# Altium schematic sheet BMS_rev2.SchDoc
size A4
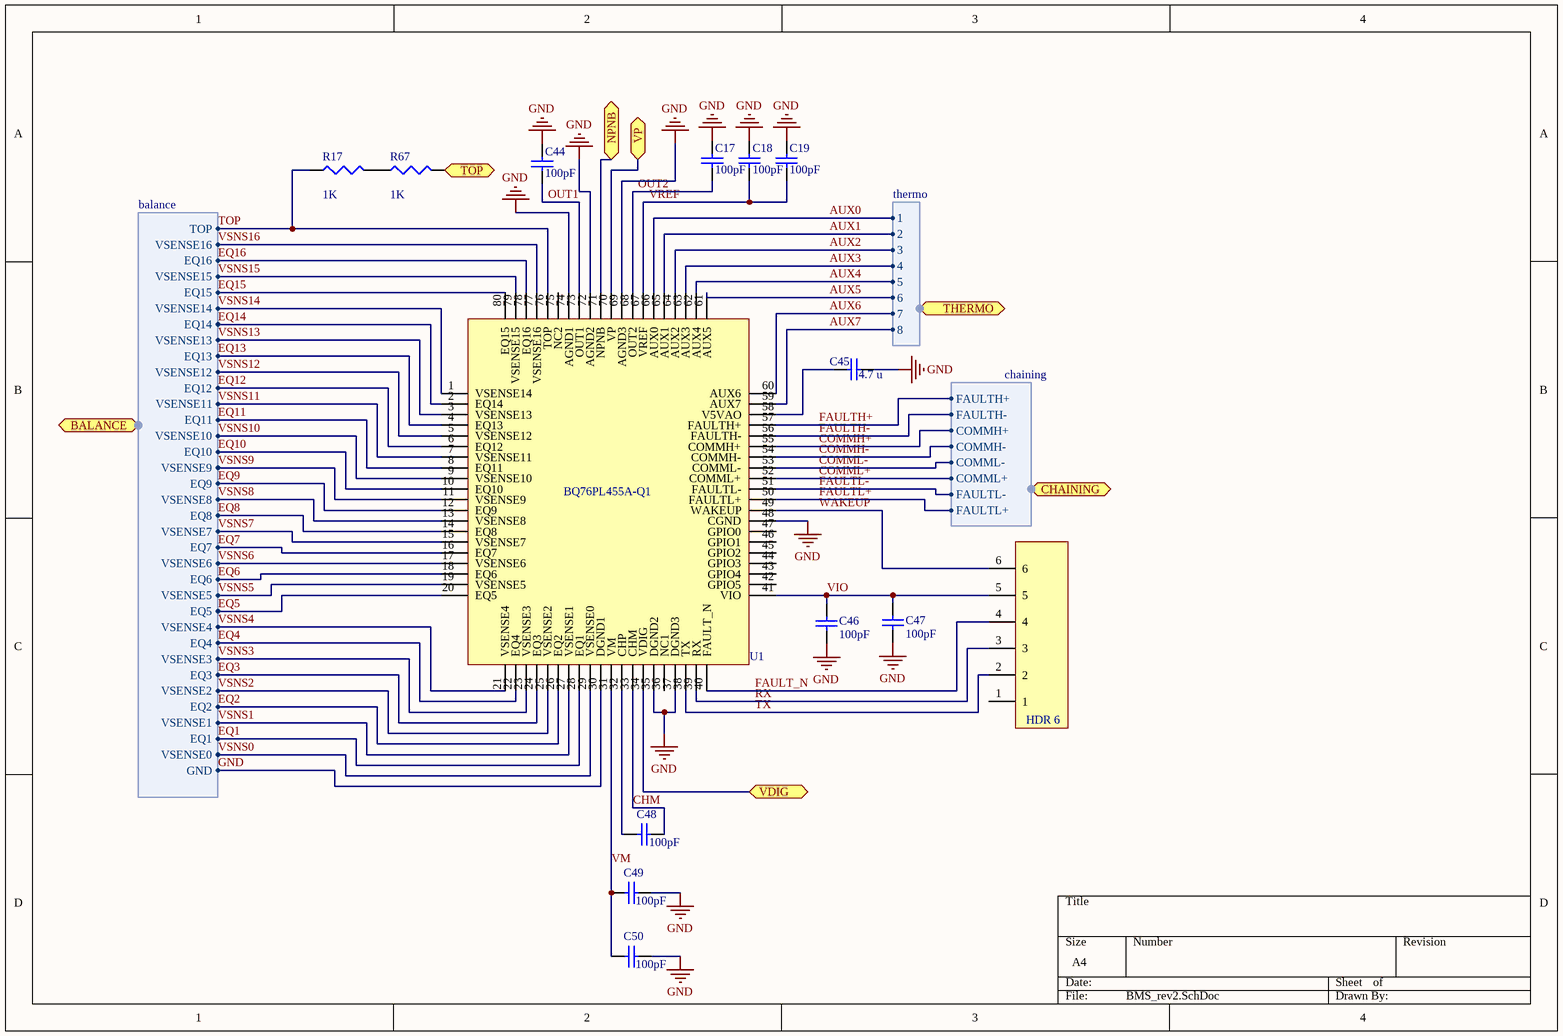
[diagram p0: BMS_rev2.SchDoc]

## Parts
?  HDR 6
C17  value 100pF  [C1206]  (hidden comment: Cap Semi)
C18  value 100pF  [C1206]  (hidden comment: Cap Semi)
C19  value 100pF  [C1206]  (hidden comment: Cap Semi)
C44  value 100pF  [C1206]  (hidden comment: Cap Semi)
C45  value 4.7 u  [C1206]  (hidden comment: Cap Semi)
C46  value 100pF  [C1206]  (hidden comment: Cap Semi)
C47  value 100pF  [C1206]  (hidden comment: Cap Semi)
C48  value 100pF  [C1206]  (hidden comment: Cap Semi)
C49  value 100pF  [C1206]  (hidden comment: Cap Semi)
C50  value 100pF  [C1206]  (hidden comment: Cap Semi)
R17  value 1K  [J1-0603]  (hidden comment: RES3)
R67  value 1K  [J1-0603]  (hidden comment: RES3)
U1  BQ76PL455A-Q1

## Ports
BALANCE (harness balance), CHAINING (harness chaining), NPNB, THERMO (harness thermo), TOP, VDIG, VP

## Harnesses
balance: TOP, VSENSE16, EQ16, VSENSE15, EQ15, VSENSE14, EQ14, VSENSE13, EQ13, VSENSE12, EQ12, VSENSE11, EQ11, VSENSE10, EQ10, VSENSE9, EQ9, VSENSE8, EQ8, VSENSE7, EQ7, VSENSE6, EQ6, VSENSE5, EQ5, VSENSE4, EQ4, VSENSE3, EQ3, VSENSE2, EQ2, VSENSE1, EQ1, VSENSE0, GND
chaining: FAULTH+, FAULTH-, COMMH+, COMMH-, COMML-, COMML+, FAULTL-, FAULTL+
thermo: 1, 2, 3, 4, 5, 6, 7, 8

## Nets
GND: C17.1 C18.1 C19.1 C44.1 C45.2 C46.1 C47.1 C49.2 C50.2 U1.30(DGND1) U1.35(DGND2) U1.37(DGND3) U1.48(CGND) U1.69(AGND3) U1.72(AGND2) U1.74(AGND1) ; port BALANCE.GND
AUX0: U1.66(AUX0) ; port THERMO.1
AUX1: U1.65(AUX1) ; port THERMO.2
AUX2: U1.64(AUX2) ; port THERMO.3
AUX3: U1.63(AUX3) ; port THERMO.4
AUX4: U1.62(AUX4) ; port THERMO.5
AUX5: U1.61(AUX5) ; port THERMO.6
AUX6: U1.60(AUX6) ; port THERMO.7
AUX7: U1.59(AUX7) ; port THERMO.8
CHM: C48.2 U1.33(CHM)
COMMH+: U1.55(COMMH+) ; port CHAINING.COMMH+
COMMH-: U1.54(COMMH-) ; port CHAINING.COMMH-
COMML+: U1.52(COMML+) ; port CHAINING.COMML+
COMML-: U1.53(COMML-) ; port CHAINING.COMML-
EQ1: U1.28(EQ1) ; port BALANCE.EQ1
EQ2: U1.26(EQ2) ; port BALANCE.EQ2
EQ3: U1.24(EQ3) ; port BALANCE.EQ3
EQ4: U1.22(EQ4) ; port BALANCE.EQ4
EQ5: U1.20(EQ5) ; port BALANCE.EQ5
EQ6: U1.18(EQ6) ; port BALANCE.EQ6
EQ7: U1.16(EQ7) ; port BALANCE.EQ7
EQ8: U1.14(EQ8) ; port BALANCE.EQ8
EQ9: U1.12(EQ9) ; port BALANCE.EQ9
EQ10: U1.10(EQ10) ; port BALANCE.EQ10
EQ11: U1.8(EQ11) ; port BALANCE.EQ11
EQ12: U1.6(EQ12) ; port BALANCE.EQ12
EQ13: U1.4(EQ13) ; port BALANCE.EQ13
EQ14: U1.2(EQ14) ; port BALANCE.EQ14
EQ15: U1.80(EQ15) ; port BALANCE.EQ15
EQ16: U1.78(EQ16) ; port BALANCE.EQ16
FAULT_N: ?.4 U1.40(FAULT_N)
FAULTH+: U1.57(FAULTH+) ; port CHAINING.FAULTH+
FAULTH-: U1.56(FAULTH-) ; port CHAINING.FAULTH-
FAULTL+: U1.50(FAULTL+) ; port CHAINING.FAULTL+
FAULTL-: U1.51(FAULTL-) ; port CHAINING.FAULTL-
NPNB: U1.71(NPNB) ; port NPNB
OUT1: C44.2 U1.73(OUT1)
OUT2: C17.2 U1.68(OUT2)
RX: ?.3 U1.39(RX)
TOP: R17.1 U1.76(TOP) ; port BALANCE.TOP
TOP: R67.2 ; port TOP  [a separate net that carries the same name]
TX: ?.2 U1.38(TX)
VDIG: U1.34(VDIG) ; port VDIG
VIO: ?.5 C46.2 C47.2 U1.41(VIO)
VM: C49.1 C50.1 U1.31(VM)
VP: U1.70(VP) ; port VP
VREF: C18.2 C19.2 U1.67(VREF)
VSNS0: U1.29(VSENSE0) ; port BALANCE.VSENSE0
VSNS1: U1.27(VSENSE1) ; port BALANCE.VSENSE1
VSNS2: U1.25(VSENSE2) ; port BALANCE.VSENSE2
VSNS3: U1.23(VSENSE3) ; port BALANCE.VSENSE3
VSNS4: U1.21(VSENSE4) ; port BALANCE.VSENSE4
VSNS5: U1.19(VSENSE5) ; port BALANCE.VSENSE5
VSNS6: U1.17(VSENSE6) ; port BALANCE.VSENSE6
VSNS7: U1.15(VSENSE7) ; port BALANCE.VSENSE7
VSNS8: U1.13(VSENSE8) ; port BALANCE.VSENSE8
VSNS9: U1.11(VSENSE9) ; port BALANCE.VSENSE9
VSNS10: U1.9(VSENSE10) ; port BALANCE.VSENSE10
VSNS11: U1.7(VSENSE11) ; port BALANCE.VSENSE11
VSNS12: U1.5(VSENSE12) ; port BALANCE.VSENSE12
VSNS13: U1.3(VSENSE13) ; port BALANCE.VSENSE13
VSNS14: U1.1(VSENSE14) ; port BALANCE.VSENSE14
VSNS15: U1.79(VSENSE15) ; port BALANCE.VSENSE15
VSNS16: U1.77(VSENSE16) ; port BALANCE.VSENSE16
WAKEUP: ?.6 U1.49(WAKEUP)
NetC45_1: C45.1 U1.58(V5VAO)
NetC48_1: C48.1 U1.32(CHP)
NetR17_2: R17.2 R67.1

Not connected (* = marked no-connect by the designer): ? 1; U1 36(NC1) 42(GPIO5) 43(GPIO4) 44(GPIO3) 45(GPIO2) 46(GPIO1) 47(GPIO0) 75(NC2)

## Library data of the parts
? = HDR 6: Manufacturer: Molex; Manufacturer Part Number: 0022124062; Contact Resistance: 10mR; Number of Positions: 6; Gender: Male; Connector Type: Male Pin; Pitch: 2.54mm; Supplier 1: Digi-Key; Supplier Part Number 1: WM13446-ND; Stock 1: 3075; Pricing 1: 1=1.06, 10=0.934, 100=0.8059, 500=0.6593, 1000=0.5861, 5000=0.5128, 10000=0.4872 (USD); Mount: Through Hole; Contact Plating: Gold; Contact Material: Brass; Colour: Natural; Housing Material: Nylon; Housing Colour: Natural; Min Operating Temperature: 0°C; Max Operating Temperature: 75°C; Package Quantity: 1000; Number of Rows: 1; Packaging: Bulk; Termination: Solder; Number of Contacts: 6; Orientation: Right Angle; Fastening Type: Friction; Length: 15.24mm; Contact Mating Length: 0.264inch; Depth: 14.42mm
C17-C19 C44-C50 = Cap Semi: Capacitor (Semiconductor SIM Model); Published: 8-Jun-2000; LatestRevisionDate: 29-May-2009; LatestRevisionNote: IPC-7351 Footprint Added.; PackageReference: C1206; Publisher: Altium Limited; PackageDescription: Chip Capacitor
R17 R67 = RES3: Resistor; Published: 8-Jun-2000; LatestRevisionDate: 29-May-2009; LatestRevisionNote: IPC-7351 Footprint Added.; PackageReference: J1-0603; Publisher: Altium Limited; PackageDescription: Chip Resistor